# Altium schematic sheet Altium_Circuit_2_v03_CLOCK_4Plane_Page2.schdoc
size 309 x 223 mm; Symbol: Sheet-Symbol_A4; Device: Sheet-Symbol_A4; @Project Name: The20c_v03; @Page Count: 2; @Update Date: 2024-12-30; @Create Date: 2024-12-30; @Schematic Name: v03_CLOCK_4Plane; @Page No: 2; @Page Name: v03_CLOCK_4Plane_Page2; Company: OsoLabs.tech; Reviewed: OsoLabs.tech; Version: V3.0; Page Size: A4; Part Number: v03_CLOCK_4Plane; Drawn: OsoLabs.tech; @Board Name: v03_CLOCK_4Plane; @Create Time: 03:03:15; @Update Time: 00:08:07
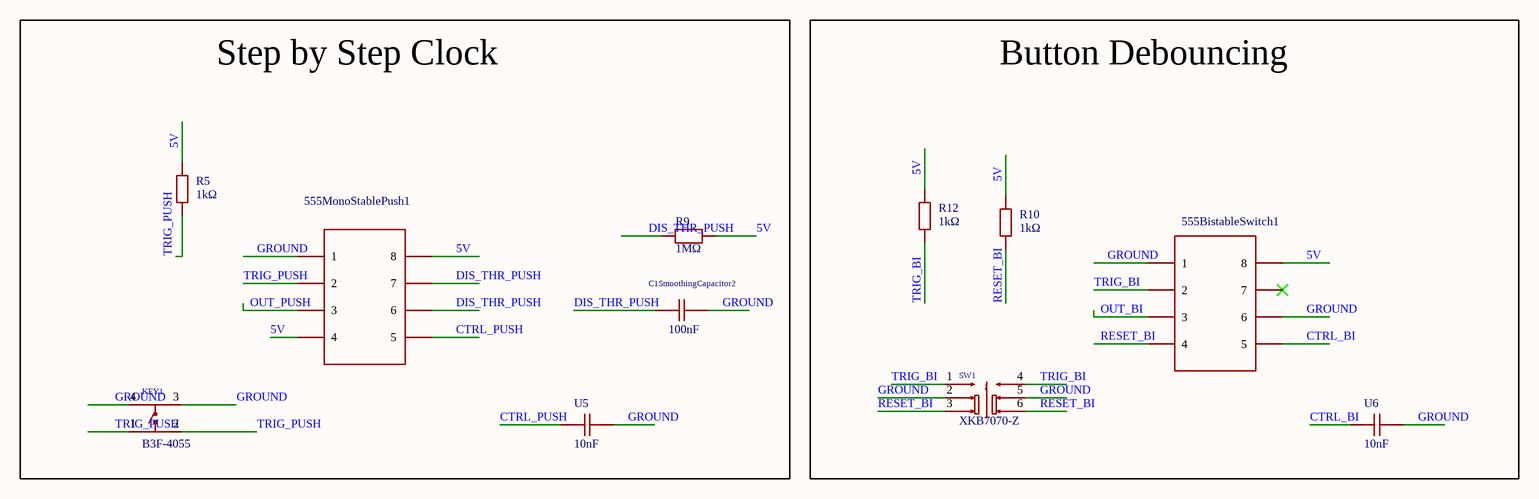
[diagram p0: Altium_Circuit_2_v03_CLOCK_4Plane_Page2.schdoc]

## Parts
555BistableSwitch1  DS1009-08AT1NX-0A2  [DIP-8_L10.2-W10.2-P2.54-LS7.6-BL]  (value not drawn)
555MonoStablePush1  DS1009-08AT1NX-0A2  [DIP-8_L10.2-W10.2-P2.54-LS7.6-BL]  (value not drawn)
C1SmoothingCapacitor2  100nF  [CAP-TH_L5.8-W2.4-P2.54-D0.6]  (value not drawn)
KEY1  B3F-4055  [KEY-TH_4P-L12.0-W12.0-P5.00-LS13.4-EH]  (value not drawn)
R5  1kΩ  [RES-TH_BD2.7-L6.2-P10.20-D0.4]  (value not drawn)
R9  1MΩ  [RES-TH_BD2.7-L6.2-P10.20-D0.4]  (value not drawn)
R10  1kΩ  [RES-TH_BD2.7-L6.2-P10.20-D0.4]  (value not drawn)
R12  1kΩ  [RES-TH_BD2.7-L6.2-P10.20-D0.4]  (value not drawn)
SW1  XKB7070-Z  [SW-TH_6P-L7.0-W7.0-P2.00]  (value not drawn)
U5  10nF  [CAP-TH_L4.8-W3.2-P5.08-D1.2]  (value not drawn)
U6  10nF  [CAP-TH_L4.8-W3.2-P5.08-D1.2]  (value not drawn)

## Blocks framed on the sheet
Step by Step Clock: 555MonoStablePush1 C1SmoothingCapacitor2 KEY1 R5 R9 U5
Button Debouncing: 555BistableSwitch1 R10 R12 SW1 U6

## Nets
5V: 555BistableSwitch1.8 555MonoStablePush1.4 555MonoStablePush1.8 R5.2 R9.1 R10.2 R12.2
CTRL_BI: 555BistableSwitch1.5 U6.1
CTRL_PUSH: 555MonoStablePush1.5 U5.1
DIS_THR_PUSH: 555MonoStablePush1.6 555MonoStablePush1.7 C1SmoothingCapacitor2.1 R9.2
GROUND: 555BistableSwitch1.1 555BistableSwitch1.6 555MonoStablePush1.1 C1SmoothingCapacitor2.2 KEY1.3 KEY1.4 SW1.2 SW1.5 U5.2 U6.2
OUT_BI: 555BistableSwitch1.3
OUT_PUSH: 555MonoStablePush1.3
RESET_BI: 555BistableSwitch1.4 R10.1 SW1.3 SW1.6
TRIG_BI: 555BistableSwitch1.2 R12.1 SW1.1 SW1.4
TRIG_PUSH: 555MonoStablePush1.2 KEY1.1 KEY1.2 R5.1

Not connected (* = marked no-connect by the designer): 555BistableSwitch1 7*

## Notes on the sheet
- 1
- 2
- 3
- 4
- 5
- 6
- A
- B
- C
- Schematic
- v03_CLOCK_4Plane
- Create Date
- Update Date
- 2024-12-30
- Reviewed
- Drawn
- Page
- OsoLabs.tech
- v03_CLOCK_4Plane_Page2
- Part Number
- The20c_v03
- D
- VER
- SIZE
- PAGE
- OF
- V3.0
- A4

## Library data of the parts
555BistableSwitch1 555MonoStablePush1 = DS1009-08AT1NX-0A2: IC Type:DIP Pitch:2.54mm Row Spacing:7.62mm Number of Positions:8P Contact Plating:Tin; Manufacturer: CONNFLY; Add into BOM: yes; IC Type: DIP; Pitch: 2.54mm; Row Spacing: 7.62mm; Number of Positions: 8P; Symbol: DS1009-08AT1NX-0A2; Device: DS1009-08AT1NX-0A2; LCSC Part Name: 间距2.54mm P数:8P; Supplier Part: C72124; Manufacturer Part: DS1009-08AT1NX-0A2; Supplier Footprint: DIP-8; JLCPCB Part Class: Extended Part; Datasheet: https://atta.szlcsc.com/upload/public/pdf/source/20160429/1461922462758.pdf; Supplier: LCSC; Convert to PCB: yes; Contact Plating: Tin
C1SmoothingCapacitor2 = CC1H104ZA1ED3F5P1100: Capacitance:100nF Tolerance:-20%~+80% Tolerance:-20%~+80% Voltage Rated: Lead Spacing: Temperature Coefficient: φD: Body Thickness:2.4mm; Manufacturer: Dersonic(德尔创); Add into BOM: yes; Body Thickness: 2.4mm; Symbol: CC1H104ZA1ED3F5P1100; Device: CC1H104ZA1ED3F5P1100; Supplier: LCSC; Supplier Part: C2832506; Manufacturer Part: CC1H104ZA1ED3F5P1100; Value: 100nF; JLCPCB Part Class: Extended Part; LCSC Part Name: 100nF -20%~+80% 50V; Supplier Footprint: 插件,P=2.54mm; Datasheet: https://atta.szlcsc.com/upload/public/pdf/source/20211027/619020FDD8EBC9BBFCA73A5584FA164D.pdf; Convert to PCB: yes; Tolerance: -20%~+80%
KEY1 = B3F-4055_C84931: Circuit:SPST Actuator Style:Rectangle button Mounting Style:Straight Switch Length:12mm Switch Width:12mm Switch Height:7.3mm Contact Current:50mA Voltage Rating (DC):24V With Lamp:- Mechanical Life:-; Manufacturer: OMRON(欧姆龙); Add into BOM: yes; Circuit: SPST; Switch Length: 12mm; Switch Height: 7.3mm; Contact Current: 50mA; Voltage Rating (DC): 24V; Symbol: B3F-4055; Device: B3F-4055_C84931; Supplier: LCSC; Manufacturer Part: B3F-4055; Supplier Part: C84931; JLCPCB Part Class: Extended Part; LCSC Part Name: 12*12*7.3mm 直插 轻触开关; Supplier Footprint: 插件; Datasheet: https://atta.szlcsc.com/upload/public/pdf/source/20170810/C93157_1502335414592880008.pdf; Convert to PCB: yes; Actuator Style: Rectangle button; Mounting Style: Straight; Switch Width: 12mm; With Lamp: -; Mechanical Life: -
R5 R10 R12 = CR1/4W-1K±5%-ST26: Type:Carbon Resister Resistance: Tolerance:±5% Tolerance:±5% Overload Voltage (Max):250V Power(Watts):250mW Temperature Coefficient:±350ppm/℃ Temperature Coefficient:±350ppm/℃ Operating Temperature Range:-55℃~+155℃ Operating Temperature Range:-55℃~+155℃; Manufacturer: VO(翔胜); Add into BOM: yes; Tolerance: ±5%; Overload Voltage (Max): 250V; Power(Watts): 250mW; Symbol: CR1/4W-1K±5%-ST26; Device: CR1/4W-1K±5%-ST26; LCSC Part Name: 碳膜电阻 1kΩ ±5% 250mW; Supplier Part: C2894606; Manufacturer Part: CR1/4W-1K±5%-ST26; Supplier Footprint: 插件,2.7x6.2mm; JLCPCB Part Class: Extended Part; Datasheet: https://atta.szlcsc.com/upload/public/pdf/source/20210803/C2857407_45FF53FE186CAB545115AD37303966CD.pdf; Supplier: LCSC; Convert to PCB: yes; Type: Carbon Resister; Value: 1kΩ; Temperature Coefficient: ±350ppm/℃; Operating Temperature Range: -55℃~+155℃
R9 = CR1/4W-1M±5%-ST52: Type:Carbon Resister Resistance: Tolerance:±5% Tolerance:±5% Overload Voltage (Max):250V Power(Watts):250mW Temperature Coefficient:±1000ppm/℃ Temperature Coefficient:±1000ppm/℃ Operating Temperature Range:-55℃~+155℃ Operating Temperature Range:-55℃~+155℃; Manufacturer: VO(翔胜); Add into BOM: yes; Tolerance: ±5%; Overload Voltage (Max): 250V; Power(Watts): 250mW; Symbol: CR1/4W-1M±5%-ST52; Device: CR1/4W-1M±5%-ST52; LCSC Part Name: 碳膜电阻 1MΩ ±5% 250mW; Supplier Part: C2894664; Manufacturer Part: CR1/4W-1M±5%-ST52; Supplier Footprint: 插件,D2.7xL6.2mm; JLCPCB Part Class: Extended Part; Datasheet: https://atta.szlcsc.com/upload/public/pdf/source/20210803/C2857407_45FF53FE186CAB545115AD37303966CD.pdf; Supplier: LCSC; Convert to PCB: yes; Type: Carbon Resister; Value: 1MΩ; Temperature Coefficient: ±1000ppm/℃; Operating Temperature Range: -55℃~+155℃
SW1 = XKB7070-Z: Self Lock / No Lock:LATCHING Actuator Style:Rectangle button IP Rating:- Mounting Style:Straight Contact Current:100mA Voltage Rating (AC):250V Voltage Rating (DC):30V Insulation Resistance:100MΩ Actuator/Cap Color:Blue With Lamp:不带 Pin Style:PCPin Operat; Manufacturer: XKB Connectivity(中国星坤); Add into BOM: yes; Contact Current: 100mA; Voltage Rating (AC): 250V; Voltage Rating (DC): 30V; Insulation Resistance: 100MΩ; Actuator/Cap Color: Blue; With Lamp: 不带; Pin Style: PCPin; Operating Force: 160gf; Mechanical Life: 10万次; Symbol: XKB7070-Z; Device: XKB7070-Z; Supplier: LCSC; Supplier Part: C318863; Manufacturer Part: XKB7070-Z; JLCPCB Part Class: Extended Part; LCSC Part Name: 按键开关   7*7插件自锁 蓝白黑; Supplier Footprint: 插件; Datasheet: https://atta.szlcsc.com/upload/public/pdf/source/20211015/75A682A27A424BDE8D93C2CFA14C38FE.pdf; Convert to PCB: yes; Self Lock / No Lock: LATCHING; Actuator Style: Rectangle button; IP Rating: -; Mounting Style: Straight; Operating Temperature: -15℃~+55℃
U5 U6 = CC1H103ZC1ED3F4D1100: Capacitance:10nF Tolerance:-20%~+80% Tolerance:-20%~+80% Voltage Rated: Lead Spacing: Temperature Coefficient: φD: Body Thickness:2.6mm; Manufacturer: Dersonic(德尔创); Add into BOM: yes; Body Thickness: 2.6mm; Symbol: CC1H103ZC1ED3F4D1100; Device: CC1H103ZC1ED3F4D1100; LCSC Part Name: 10nF -20%~+80% 50V; Supplier Part: C2761727; Manufacturer Part: CC1H103ZC1ED3F4D1100; Supplier Footprint: 插件,P=5.08mm; JLCPCB Part Class: Extended Part; Datasheet: https://atta.szlcsc.com/upload/public/pdf/source/20211026/557BD244E4A8D86E9C6A3DB53C19BB73.pdf; Supplier: LCSC; Convert to PCB: yes; Value: 10nF; Tolerance: -20%~+80%